# Altium project ECE453-S22_LEDs.PrjPcb
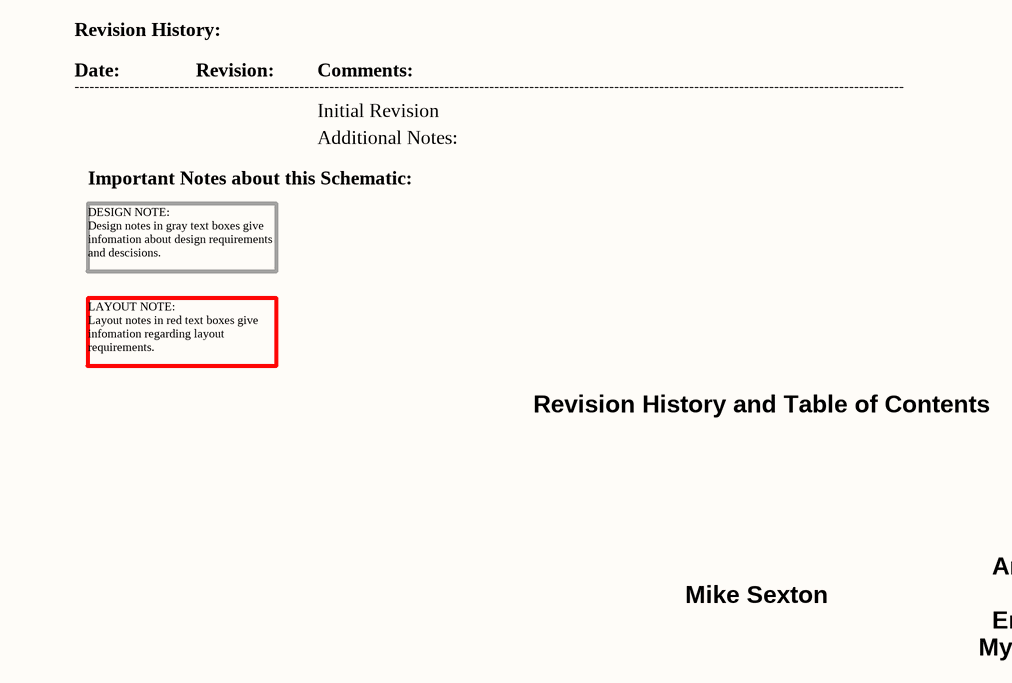
[diagram p0: 01-Revision_History_and_Contents.SchDoc]
3 sheets, 42 parts. Net scope: global (net labels, ports and power ports of the same name join across sheets).
Board file: ECE453_Interface_LEDs.PcbDoc
Sheets:
  01-Revision_History_and_Contents.SchDoc
  02_Input.SchDoc
  03_LEDs_0_4.SchDoc

## Sheet 01-Revision_History_and_Contents.SchDoc: Revision History and Contents
size A; Date: 4/25/2017; ApprovedBy: JSK; CheckedBy: JSK; Author: JSK; CompanyName: University of Wisconsin; DrawnBy: JSK; Engineer: JSK; Organization: ECE 315; Address1: College of Engineering; Address2: 1415 Engineering Drive; Address3: Madison, WI 53706; Address4: ECE 453 Spring 2017; Revision: A; SheetNumber: 1; SheetTotal: 2

### Notes on the sheet
- Revision History:
- Date:
- ----------------------------------------------------------------------------------------------------------------------------------------------------------------------
- Revision:
- Comments:
- Initial Revision
- Important Notes about this Schematic:
- Additional Notes:
- DESIGN NOTE:
  Design notes in gray text boxes give infomation about design requirements and descisions.
- LAYOUT NOTE:
  Layout notes in red text boxes give infomation regarding layout requirements.
- Revision History and Table of Contents
- Mike Sexton
- Anna Stephan
- Mya Schmitz
- Emily Cebasek

## Sheet 02_Input.SchDoc
size A
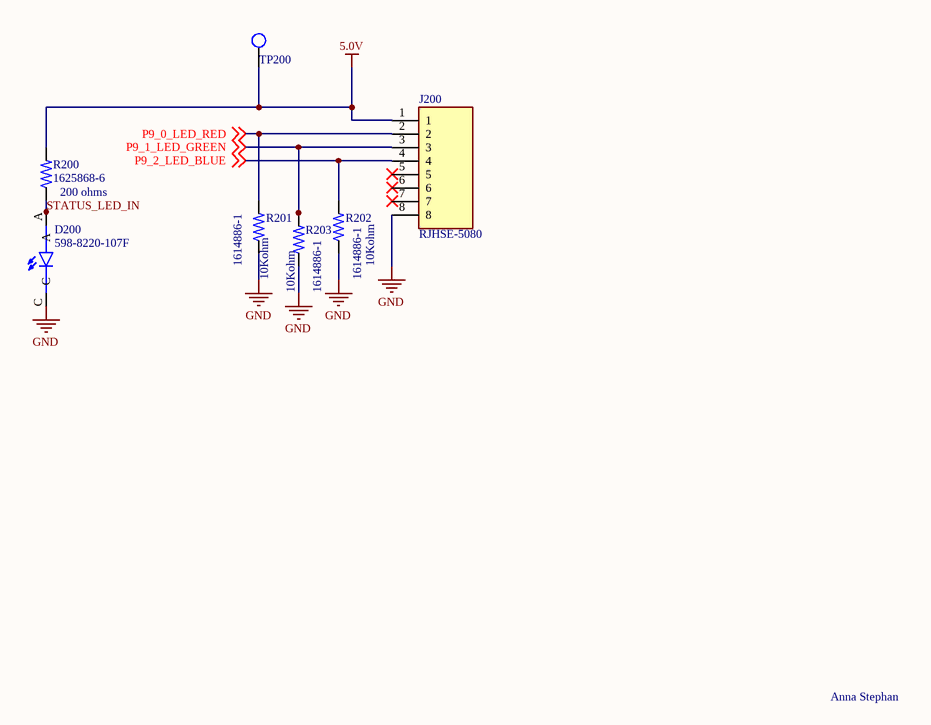
[diagram p1: 02_Input.SchDoc]

### Parts
D200  598-8220-107F  [LEDSC160X320X90-2N]
J200  RJHSE-5080  [CONN_RJSBE5080_16P13X12P57_AMP]
R200  1625868-6  [RESC2012X65N]
R201  1614886-1  [RESC2012X65N]
R202  1614886-1  [RESC2012X65N]
R203  1614886-1  [RESC2012X65N]
TP200  TP_1206  [TP-SMC-1206]  (value not drawn)

### Nets
5.0V: R200.2 TP200.1
GND: D200.C J200.8 R201.1 R202.1 R203.1
P9_0_LED_RED: J200.2 R201.2 ; off-sheet P9_0_LED_RED
P9_1_LED_GREEN: J200.3 R203.2 ; off-sheet P9_1_LED_GREEN
P9_2_LED_BLUE: J200.4 R202.2 ; off-sheet P9_2_LED_BLUE
STATUS_LED_IN: D200.A R200.1

Not connected (* = marked no-connect by the designer): J200 1 5 6 7

### Notes on the sheet
- (near R200) 200 ohms
- (near R201) 10Kohm
- 10Kohm
- (near R203) 10Kohm
- Anna Stephan

### Library data of the parts
D200 = 598-8220-107F: Red 625nm LED Indication - Discrete 2V 1206 _3216 Metric_; MF: Dialight; Value: *; MP: 598-8220-107F; Package: 1206 Dialight; SnapEDA_Link: https://www.snapeda.com/parts/598-8220-107F/Dialight/view-part/454138/?ref=snap
J200 = RJHSE-5080: Jack Modular Connector 8p8c (RJ45, Ethernet) 90Â° Angle (Right) Unshielded; Manufacturer: Amphenol CS (Commercial Products); MF: Amphenol Commercial Products; MP: RJHSE-5080; SnapEDA_Link: https://www.snapeda.com/parts/RJHSE-5080/Amphenol/view-part/4796273/?ref=snap; Package: None; Value: *; Digi-Key_Part_Number: RJHSE-5080-ND; Manufacturer Part No.: RJHSE-5080; Digikey Part No.: RJHSE-5080-ND
R200 = 1625868-6: Resistor 0805 200R 0.1% 25ppm (reel); Package: None; Price: None; Value: *; MP: 1625868-6; Availability: Unavailable
R201-R203 = 1614886-1: CPF0805 10K 0.1% 25PPM 5K RL; Power_Rating: .1 W; Tolerance: .1%; Voltage_Rating: 100 V; MF: TE Connectivity; Availability: Warning; Price: None; Package: 0805; MP: 1614886-1; Value: *; EU_RoHS_Compliance: Compliant; SnapEDA_Link: https://www.snapeda.com/parts/1614886-1/TE%20Connectivity/view-part/2202344/?ref=snap; Resistance: 10K; Check_prices: https://www.snapeda.com/parts/1614886-1/TE%20Connectivity/view-part/2202344/?ref=eda
TP200 = TP_1206: Test Point SMD 1206; Manufacturer: TE Connectivity (Tyco Electronics); Manufacturer Part Number: 1625854-1; Resistance Value: 0 Ohm; Temperature Coefficient: N/R; Supplier: Digi-Key; Stock 1: 31937; Pricing 1: 1=0.28, 10=0.261, 25=0.224, 50=0.1902, 100=0.1828, 250=0.1641, 500=0.1567, 1000=0.1306 (USD); Case Size: 1206; Dimension: 3.2 x 1.6 x 1.25mm; Family: RC; Mounting: Surface Mount; Operating Temperature: -55 to 125 C; Part No: 1625854-1; RoHS: Yes; Packaging: Tape and Reel; Termination Style: N/R; Terminal Pitch: N/R; Power Rating: N/R; Tolerance: N/R; ComponentLink1URL: https://datasheet.ciiva.com/6439/eng-ds-1773266-a-6439169.pdf; ComponentLink1Description: https://datasheet.ciiva.com/6439/eng-ds-1773266-a-6439169.pdf; ComponentLink2URL: https://datasheet.ciiva.com/30136/1773266-a-30136341.pdf; ComponentLink2Description: https://datasheet.ciiva.com/30136/1773266-a-30136341.pdf; ComponentLink3URL: https://datasheet.ciiva.com/6439/eng-ds-1773266-a-6439080.pdf; ComponentLink3Description: https://datasheet.ciiva.com/6439/eng-ds-1773266-a-6439080.pdf; ComponentLink4URL: https://datasheet.ciiva.com/6439/eng-ds-1773266-a-6439081.pdf; ComponentLink4Description: https://datasheet.ciiva.com/6439/eng-ds-1773266-a-6439081.pdf; ComponentLink5URL: https://datasheet.ciiva.com/6439/eng-ds-1773266-a-6439083.pdf; ComponentLink5Description: https://datasheet.ciiva.com/6439/eng-ds-1773266-a-6439083.pdf; Supplier Part Number: A106143CT-ND

## Sheet 03_LEDs_0_4.SchDoc
size A
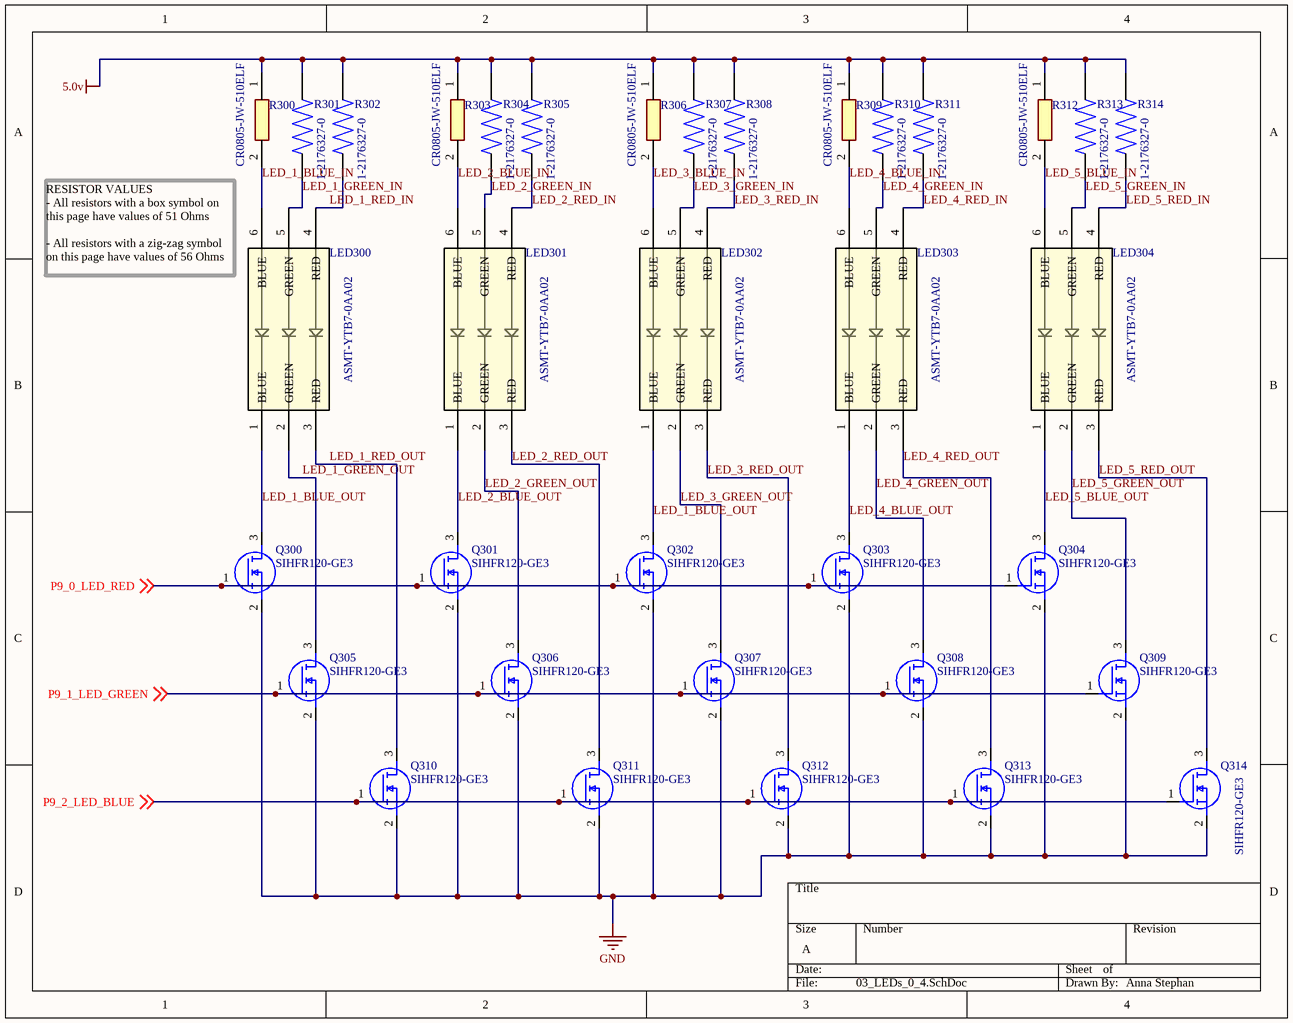
[diagram p2: 03_LEDs_0_4.SchDoc]

### Parts
LED300  ASMT-YTB7-0AA02  [LED_ASMT-YTD7-0AA02]
LED301  ASMT-YTB7-0AA02  [LED_ASMT-YTD7-0AA02]
LED302  ASMT-YTB7-0AA02  [LED_ASMT-YTD7-0AA02]
LED303  ASMT-YTB7-0AA02  [LED_ASMT-YTD7-0AA02]
LED304  ASMT-YTB7-0AA02  [LED_ASMT-YTD7-0AA02]
Q300  SIHFR120-GE3  [SIHFR120GE3]
Q301  SIHFR120-GE3  [SIHFR120GE3]
Q302  SIHFR120-GE3  [SIHFR120GE3]
Q303  SIHFR120-GE3  [SIHFR120GE3]
Q304  SIHFR120-GE3  [SIHFR120GE3]
Q305  SIHFR120-GE3  [SIHFR120GE3]
Q306  SIHFR120-GE3  [SIHFR120GE3]
Q307  SIHFR120-GE3  [SIHFR120GE3]
Q308  SIHFR120-GE3  [SIHFR120GE3]
Q309  SIHFR120-GE3  [SIHFR120GE3]
Q310  SIHFR120-GE3  [SIHFR120GE3]
Q311  SIHFR120-GE3  [SIHFR120GE3]
Q312  SIHFR120-GE3  [SIHFR120GE3]
Q313  SIHFR120-GE3  [SIHFR120GE3]
Q314  SIHFR120-GE3  [SIHFR120GE3]
R300  CR0805-JW-510ELF  [RESC2012X60N]
R301  1-2176327-0  [RESC2012X65N]
R302  1-2176327-0  [RESC2012X65N]
R303  CR0805-JW-510ELF  [RESC2012X60N]
R304  1-2176327-0  [RESC2012X65N]
R305  1-2176327-0  [RESC2012X65N]
R306  CR0805-JW-510ELF  [RESC2012X60N]
R307  1-2176327-0  [RESC2012X65N]
R308  1-2176327-0  [RESC2012X65N]
R309  CR0805-JW-510ELF  [RESC2012X60N]
R310  1-2176327-0  [RESC2012X65N]
R311  1-2176327-0  [RESC2012X65N]
R312  CR0805-JW-510ELF  [RESC2012X60N]
R313  1-2176327-0  [RESC2012X65N]
R314  1-2176327-0  [RESC2012X65N]

### Nets
5.0V: R300.1 R301.2 R302.2 R303.1 R304.2 R305.2 R306.1 R307.2 R308.2 R309.1 R310.2 R311.2 R312.1 R313.2 R314.2
GND: Q300.2(S) Q301.2(S) Q302.2(S) Q303.2(S) Q304.2(S) Q305.2(S) Q306.2(S) Q307.2(S) Q308.2(S) Q309.2(S) Q310.2(S) Q311.2(S) Q312.2(S) Q313.2(S) Q314.2(S)
LED_1_BLUE_IN: LED300.6(BLUE) R300.2
LED_1_BLUE_OUT: LED300.1(BLUE) LED302.1(BLUE) Q300.3(D) Q302.3(D)
LED_1_GREEN_IN: LED300.5(GREEN) R301.1
LED_1_GREEN_OUT: LED300.2(GREEN) Q305.3(D)
LED_1_RED_IN: LED300.4(RED) R302.1
LED_1_RED_OUT: LED300.3(RED) Q310.3(D)
LED_2_BLUE_IN: LED301.6(BLUE) R303.2
LED_2_BLUE_OUT: LED301.1(BLUE) Q301.3(D)
LED_2_GREEN_IN: LED301.5(GREEN) R304.1
LED_2_GREEN_OUT: LED301.2(GREEN) Q306.3(D)
LED_2_RED_IN: LED301.4(RED) R305.1
LED_2_RED_OUT: LED301.3(RED) Q311.3(D)
LED_3_BLUE_IN: LED302.6(BLUE) R306.2
LED_3_GREEN_IN: LED302.5(GREEN) R307.1
LED_3_GREEN_OUT: LED302.2(GREEN) Q307.3(D)
LED_3_RED_IN: LED302.4(RED) R308.1
LED_3_RED_OUT: LED302.3(RED) Q312.3(D)
LED_4_BLUE_IN: LED303.6(BLUE) R309.2
LED_4_BLUE_OUT: LED303.1(BLUE) Q303.3(D)
LED_4_GREEN_IN: LED303.5(GREEN) R310.1
LED_4_GREEN_OUT: LED303.2(GREEN) Q308.3(D)
LED_4_RED_IN: LED303.4(RED) R311.1
LED_4_RED_OUT: LED303.3(RED) Q313.3(D)
LED_5_BLUE_IN: LED304.6(BLUE) R312.2
LED_5_BLUE_OUT: LED304.1(BLUE) Q304.3(D)
LED_5_GREEN_IN: LED304.5(GREEN) R313.1
LED_5_GREEN_OUT: LED304.2(GREEN) Q309.3(D)
LED_5_RED_IN: LED304.4(RED) R314.1
LED_5_RED_OUT: LED304.3(RED) Q314.3(D)
P9_0_LED_RED: Q300.1(G) Q301.1(G) Q302.1(G) Q303.1(G) Q304.1(G) ; off-sheet P9_0_LED_RED
P9_1_LED_GREEN: Q305.1(G) Q306.1(G) Q307.1(G) Q308.1(G) Q309.1(G) ; off-sheet P9_1_LED_GREEN
P9_2_LED_BLUE: Q310.1(G) Q311.1(G) Q312.1(G) Q313.1(G) Q314.1(G) ; off-sheet P9_2_LED_BLUE

### Notes on the sheet
- (near LED300) RESISTOR VALUES
  - All resistors with a box symbol on this page have values of 51 Ohms
  - All resistors with a zig-zag symbol on this page have values of 56 Ohms
- Anna Stephan

### Library data of the parts
LED300-LED304 = ASMT-YTB7-0AA02: No Description Available; Mfr_Name: Broadcom; Type: DEV; Copyright: Copyright (C) 2022 Ultra Librarian. All rights reserved.; Manufacturer_Part_Number: ASMT-YTB7-0AA02; Digi-Key_Part_Number_1: ASMT-YTB7-0AA02-ND; Digi-Key_Part_Number_2: 516-3132-2-ND; Digi-Key_Part_Number_3: 516-3132-1-ND; Digi-Key_Part_Number_4: 516-3132-6-ND; RefDes: RefDes
Q300-Q314 = SIHFR120-GE3: MOSFET (N-Channel); Manufacturer_Name: Vishay; Datasheet Link: https://www.mouser.in/datasheet/2/427/91266-1768752.pdf; Height: 2.38mm; Manufacturer_Part_Number: SIHFR120-GE3
R300 R303 R306 R309 R312 = CR0805-JW-510ELF: Resistor; Manufacturer_Name: Bourns; Datasheet Link: https://www.bourns.com/pdfs/chpreztr.pdf; Height: 0.6mm; Manufacturer_Part_Number: CR0805-JW-510ELF
R301 R302 R304 R305 R307 R308 R310 R311 R313 R314 = 1-2176327-0: Fixed Resistor CRGP 0805 56R 1%; Package: None; Price: None; Value: *; MP: 1-2176327-0; Availability: Unavailable

## Nets that join several sheets
5.0V: 02_Input (R200.2 TP200.1), 03_LEDs_0_4 (15 pins)
GND: 02_Input (5 pins), 03_LEDs_0_4 (15 pins)
P9_0_LED_RED: 02_Input (J200.2 R201.2), 03_LEDs_0_4 (5 pins)
P9_1_LED_GREEN: 02_Input (J200.3 R203.2), 03_LEDs_0_4 (5 pins)
P9_2_LED_BLUE: 02_Input (J200.4 R202.2), 03_LEDs_0_4 (5 pins)